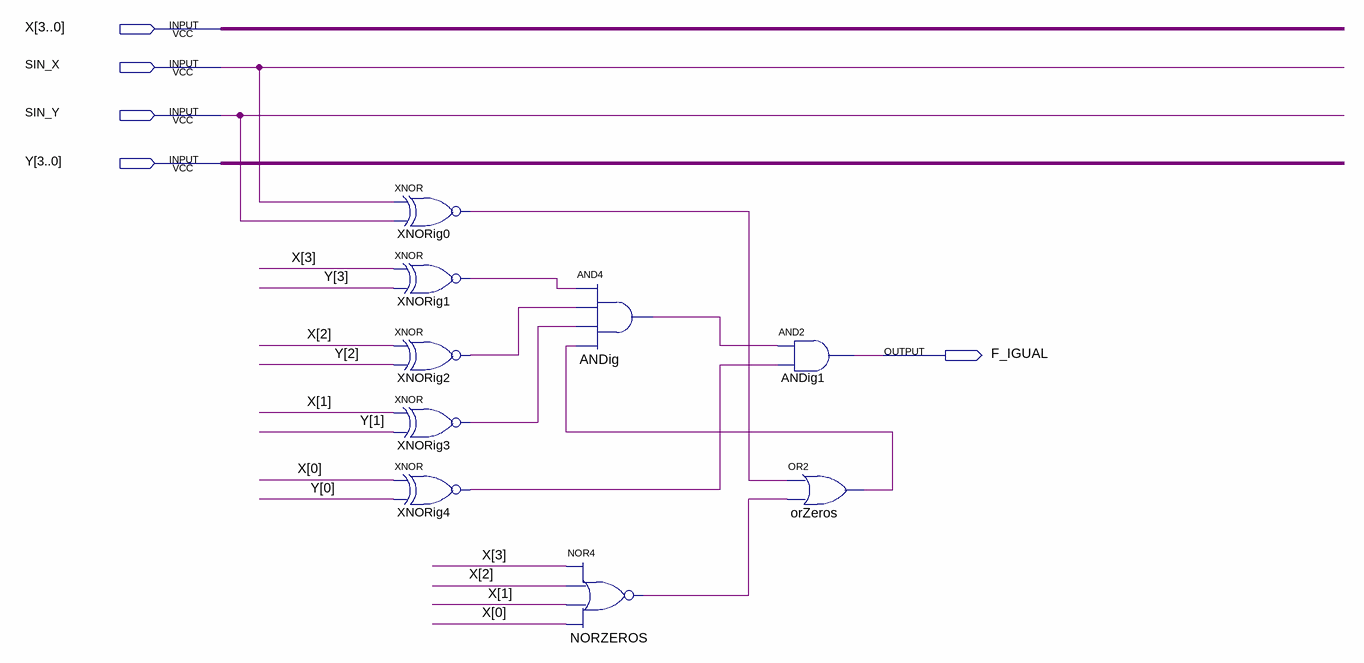
[diagram p0: schematic sheet]
// Quartus schematic Igual.bdf as structural Verilog: 9 symbols, 5 pins
module Igual (
  input  [3:0] X,
  input  SIN_X,
  input  SIN_Y,
  input  [3:0] Y,
  output F_IGUAL
);

  wire ANDig_out, NORZEROS_out, orZeros_out, XNORig0_out, XNORig1_out, XNORig2_out, XNORig3_out, XNORig4_out;

  xnor XNORig0 (XNORig0_out, SIN_X, SIN_Y);
  xnor XNORig1 (XNORig1_out, X[3], Y[3]);
  xnor XNORig2 (XNORig2_out, X[2], Y[2]);
  xnor XNORig3 (XNORig3_out, X[1], Y[1]);
  xnor XNORig4 (XNORig4_out, X[0], Y[0]);
  and ANDig (ANDig_out, XNORig1_out, XNORig2_out, XNORig3_out, orZeros_out);
  nor NORZEROS (NORZEROS_out, X[3], X[2], X[1], X[0]);
  and ANDig1 (F_IGUAL, ANDig_out, XNORig4_out);
  or orZeros (orZeros_out, XNORig0_out, NORZEROS_out);
endmodule
